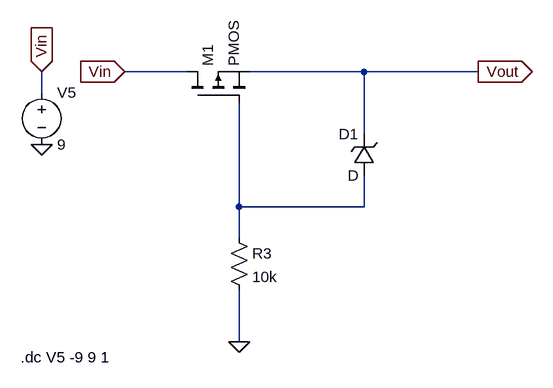
[diagram p0: schematic ReversePolarity.asc]
ReversePolarity.asc, the LTspice schematic file:
Version 4
SHEET 1 1728 680
WIRE 1168 0 1072 0
WIRE 1440 0 1264 0
WIRE 1616 0 1440 0
WIRE 944 32 944 0
WIRE 1440 96 1440 0
WIRE 1248 208 1248 48
WIRE 1440 208 1440 160
WIRE 1440 208 1248 208
WIRE 1248 256 1248 208
WIRE 1248 416 1248 336
FLAG 1248 416 0
FLAG 944 0 Vin
IOPIN 944 0 In
FLAG 1072 0 Vin
IOPIN 1072 0 In
FLAG 944 112 0
FLAG 1616 0 Vout
IOPIN 1616 0 Out
SYMBOL res 1232 240 R0
SYMATTR InstName R3
SYMATTR Value 10k
SYMBOL voltage 944 16 R0
WINDOW 123 0 0 Left 0
WINDOW 39 0 0 Left 0
SYMATTR InstName V5
SYMATTR Value 9
SYMBOL zener 1456 160 R180
WINDOW 0 24 64 Left 2
WINDOW 3 24 0 Left 2
SYMATTR InstName D1
SYMBOL pmos 1168 48 R270
SYMATTR InstName M1
TEXT 912 440 Left 2 !.dc V5 -9 9 1

The netlist it stands for:
* ReversePolarity.asc
R3 N001 0 10k
V5 Vin 0 9
D1 N001 Vout D
M1 Vin N001 Vout Vout PMOS
.model D D
.lib standard.dio
.model NMOS NMOS
.model PMOS PMOS
.lib standard.mos
.dc V5 -9 9 1
.backanno
.end